# EAGLE design BlankMSXCart (EAGLE 7.5.0)
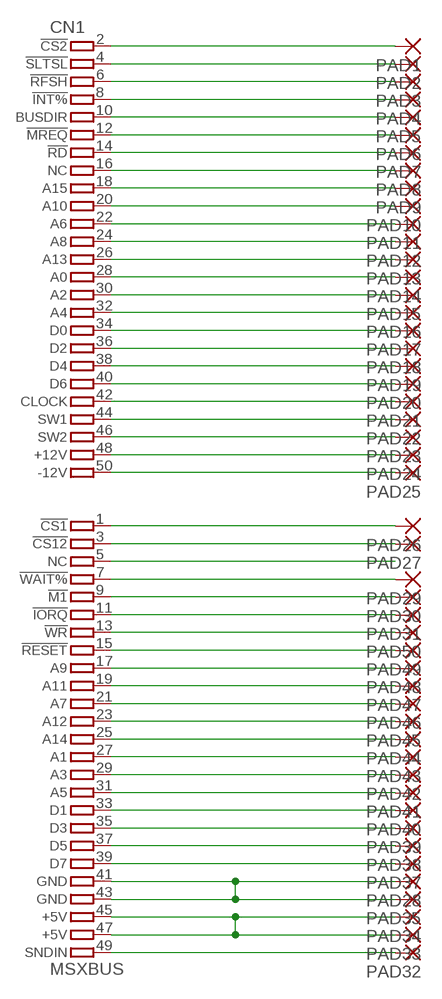
[diagram p0: schematic, sheet 1]

## Parts
CN1  MSXBUS  MSXBUS_EDGE  [MSXBUS_EDGECONN]
PAD1  1,6/0,8  [1,6/0,8]
PAD2  1,6/0,8  [1,6/0,8]
PAD3  1,6/0,8  [1,6/0,8]
PAD4  1,6/0,8  [1,6/0,8]
PAD5  1,6/0,8  [1,6/0,8]
PAD6  1,6/0,8  [1,6/0,8]
PAD7  1,6/0,8  [1,6/0,8]
PAD8  1,6/0,8  [1,6/0,8]
PAD9  1,6/0,8  [1,6/0,8]
PAD10  1,6/0,8  [1,6/0,8]
PAD11  1,6/0,8  [1,6/0,8]
PAD12  1,6/0,8  [1,6/0,8]
PAD13  1,6/0,8  [1,6/0,8]
PAD14  1,6/0,8  [1,6/0,8]
PAD15  1,6/0,8  [1,6/0,8]
PAD16  1,6/0,8  [1,6/0,8]
PAD17  1,6/0,8  [1,6/0,8]
PAD18  1,6/0,8  [1,6/0,8]
PAD19  1,6/0,8  [1,6/0,8]
PAD20  1,6/0,8  [1,6/0,8]
PAD21  1,6/0,8  [1,6/0,8]
PAD22  1,6/0,8  [1,6/0,8]
PAD23  1,6/0,8  [1,6/0,8]
PAD24  1,6/0,8  [1,6/0,8]
PAD25  1,6/0,8  [1,6/0,8]
PAD26  1,6/0,8  [1,6/0,8]
PAD27  1,6/0,8  [1,6/0,8]
PAD28  1,6/0,8  [1,6/0,8]
PAD29  1,6/0,8  [1,6/0,8]
PAD30  1,6/0,8  [1,6/0,8]
PAD31  1,6/0,8  [1,6/0,8]
PAD32  1,6/0,8  [1,6/0,8]
PAD33  1,6/0,8  [1,6/0,8]
PAD34  1,6/0,8  [1,6/0,8]
PAD35  1,6/0,8  [1,6/0,8]
PAD37  1,6/0,8  [1,6/0,8]
PAD38  1,6/0,8  [1,6/0,8]
PAD39  1,6/0,8  [1,6/0,8]
PAD40  1,6/0,8  [1,6/0,8]
PAD41  1,6/0,8  [1,6/0,8]
PAD42  1,6/0,8  [1,6/0,8]
PAD43  1,6/0,8  [1,6/0,8]
PAD44  1,6/0,8  [1,6/0,8]
PAD45  1,6/0,8  [1,6/0,8]
PAD46  1,6/0,8  [1,6/0,8]
PAD47  1,6/0,8  [1,6/0,8]
PAD48  1,6/0,8  [1,6/0,8]
PAD49  1,6/0,8  [1,6/0,8]
PAD50  1,6/0,8  [1,6/0,8]

## Nets
+5V: CN1.45(45.+5V) CN1.47(47.+5V) PAD33.1(P) PAD34.1(P)
GND: CN1.41(41.GND) CN1.43(43.GND) PAD28.1(P) PAD35.1(P)
N$1: CN1.2(2.!CS2) PAD1.1(P)
N$2: CN1.4(4.!SLTSL) PAD2.1(P)
N$4: CN1.6(6.!RFSH) PAD3.1(P)
N$6: CN1.8(8.!INT%) PAD4.1(P)
N$7: CN1.10(10.BUSDIR) PAD5.1(P)
N$8: CN1.12(12.!MREQ) PAD6.1(P)
N$9: CN1.14(14.!RD) PAD7.1(P)
N$10: CN1.16(16.NC) PAD8.1(P)
N$11: CN1.18(18.A15) PAD9.1(P)
N$12: CN1.20(20.A10) PAD10.1(P)
N$13: CN1.22(22.A6) PAD11.1(P)
N$14: CN1.24(24.A8) PAD12.1(P)
N$15: CN1.26(26.A13) PAD13.1(P)
N$16: CN1.28(28.A0) PAD14.1(P)
N$17: CN1.30(30.A2) PAD15.1(P)
N$18: CN1.32(32.A4) PAD16.1(P)
N$19: CN1.34(34.D0) PAD17.1(P)
N$20: CN1.36(36.D2) PAD18.1(P)
N$21: CN1.38(38.D4) PAD19.1(P)
N$22: CN1.40(40.D6) PAD20.1(P)
N$23: CN1.42(42.CLOCK) PAD21.1(P)
N$24: CN1.44(44.SW1) PAD22.1(P)
N$25: CN1.46(46.SW2) PAD23.1(P)
N$26: CN1.48(48.+12V) PAD24.1(P)
N$27: CN1.50(50.-12V) PAD25.1(P)
N$28: CN1.1(1.!CS1) PAD26.1(P)
N$29: CN1.3(3.!CS12) PAD27.1(P)
N$30: CN1.5(5.NC)
N$31: CN1.7(7.!WAIT%) PAD29.1(P)
N$32: CN1.9(9.!M1) PAD30.1(P)
N$33: CN1.11(11.!IORQ) PAD31.1(P)
N$34: CN1.49(49.SNDIN) PAD32.1(P)
N$39: CN1.39(39.D7) PAD37.1(P)
N$40: CN1.37(37.D5) PAD38.1(P)
N$41: CN1.35(35.D3) PAD39.1(P)
N$42: CN1.33(33.D1) PAD40.1(P)
N$43: CN1.31(31.A5) PAD41.1(P)
N$44: CN1.29(29.A3) PAD42.1(P)
N$45: CN1.27(27.A1) PAD43.1(P)
N$46: CN1.25(25.A14) PAD44.1(P)
N$47: CN1.23(23.A12) PAD45.1(P)
N$48: CN1.21(21.A7) PAD46.1(P)
N$49: CN1.19(19.A11) PAD47.1(P)
N$302: CN1.17(17.A9) PAD48.1(P)
N$303: CN1.15(15.!RESET) PAD49.1(P)
N$304: CN1.13(13.!WR) PAD50.1(P)

## Library data of the parts
CN1 = msx_breadboards:MSXBUS_EDGE: MSX bus (50 pin) edge connector Created 2013 by Eugeny Brychkov
PAD1-PAD35 PAD37-PAD50 = wirepad:1,6/0,8: THROUGH-HOLE PAD

## Board
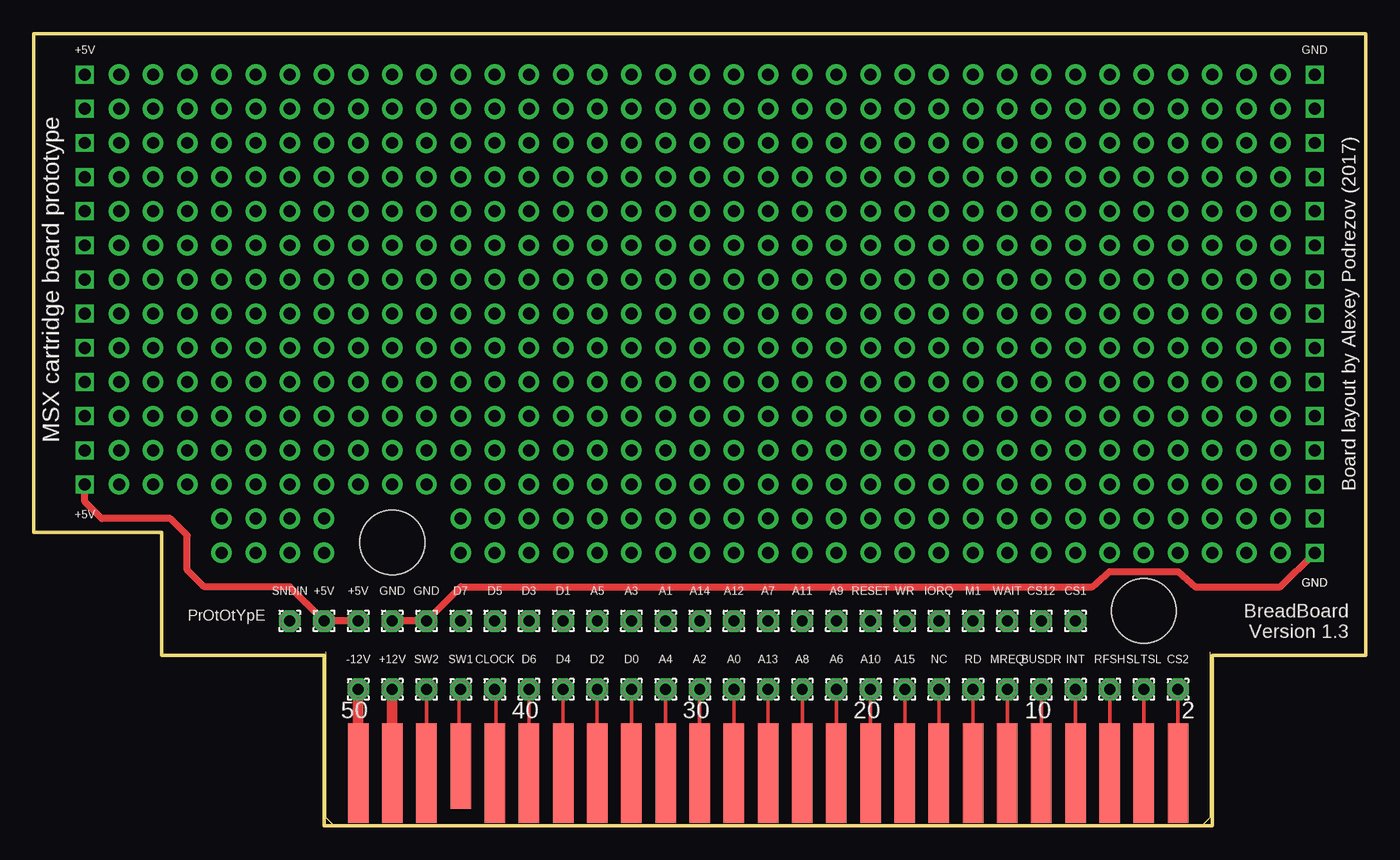
[diagram p1: board, top side]
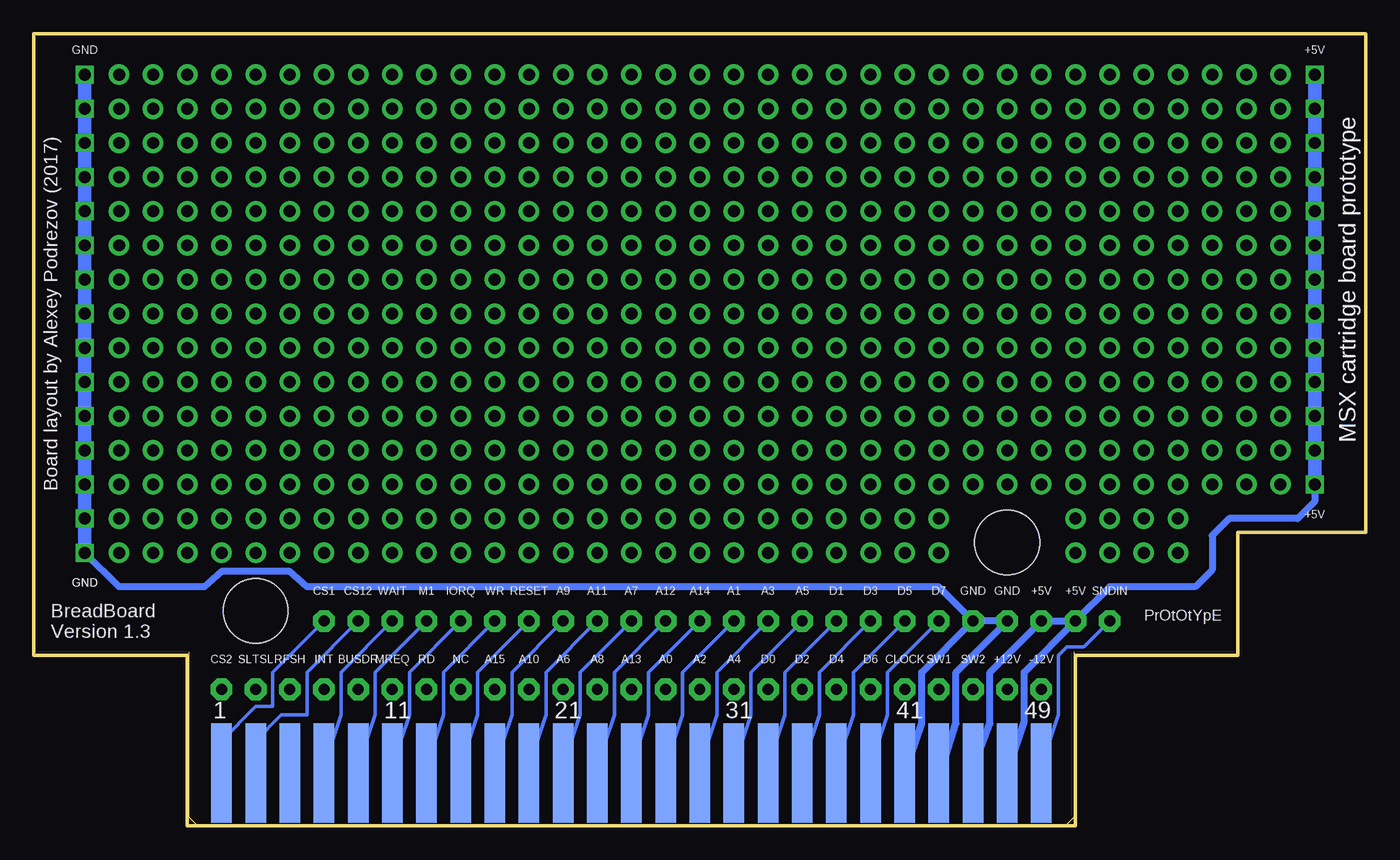
[diagram p2: board, bottom side, seen from below]

Size 99.06 x 58.93 mm. Coordinates in mm from the lower left corner, seen from the top.
Outline: 87.63,12.7 99.06,12.7 99.06,58.93 0,58.93 0,21.84 9.53,21.84 9.53,12.7 21.59,12.7 21.59,0 87.63,0 87.63,12.7
Copper layers (1*16): Top 0.035mm / dielectric 1.5mm / Bottom 0.035mm
Design rules "default *": minimum track width 10mil, minimum drill 24mil, track to track 8mil, track to pad 8mil, pad to pad 8mil, via to via 8mil, smd to smd 8mil, copper to edge 10mil, drill to drill 8mil, minimum pad ring 10mil, minimum via ring 8mil, stop-mask expansion 4mil, vias tented up to drill 0mil, thermal gap 20mil

### Footprints (pad centres in the part's own frame; a part is rotated, then mirrored left to right if it is on the bottom)
MSXBUS_EDGECONN = smd 1.524 x 7.366 bottom: 1 30.48,3.937; 3 27.94,3.937; 5 25.4,3.937; 7 22.86,3.937; 9 20.32,3.937; 11 17.78,3.937; 13 15.24,3.937; 15 12.7,3.937; 17 10.16,3.937; 19 7.62,3.937; 21 5.08,3.937; 23 2.54,3.937; 25 0,3.937; 27 -2.54,3.937; 29 -5.08,3.937; 31 -7.62,3.937; 33 -10.16,3.937; 35 -12.7,3.937; 37 -15.24,3.937; 39 -17.78,3.937; 41 -20.32,3.937; 43 -22.86,3.937; 45 -25.4,3.937; 47 -27.94,3.937; 49 -30.48,3.937 | smd 1.524 x 7.366: 2 30.48,3.937; 4 27.94,3.937; 6 25.4,3.937; 8 22.86,3.937; 10 20.32,3.937; 12 17.78,3.937; 14 15.24,3.937; 16 12.7,3.937; 18 10.16,3.937; 20 7.62,3.937; 22 5.08,3.937; 24 2.54,3.937; 26 0,3.937; 28 -2.54,3.937; 30 -5.08,3.937; 32 -7.62,3.937; 34 -10.16,3.937; 36 -12.7,3.937; 38 -15.24,3.937; 40 -17.78,3.937; 42 -20.32,3.937; 46 -25.4,3.937; 48 -27.94,3.937; 50 -30.48,3.937 | smd 1.524 x 6.35: 44 -22.86,4.445 | hole 4.826: -27.94,21.082; 27.94,16.002
1,6/0,8 = drill 0.813 pad 1.6 octagon: 1 0,0

### Placement (x,y rotation side)
CN1  54.61,0 0 top
PAD1  85.09,10.16 0 top
PAD2  82.55,10.16 0 top
PAD3  80.01,10.16 0 top
PAD4  77.47,10.16 0 top
PAD5  74.93,10.16 0 top
PAD6  72.39,10.16 0 top
PAD7  69.85,10.16 0 top
PAD8  67.31,10.16 0 top
PAD9  64.77,10.16 0 top
PAD10  62.23,10.16 0 top
PAD11  59.69,10.16 0 top
PAD12  57.15,10.16 0 top
PAD13  54.61,10.16 0 top
PAD14  52.07,10.16 0 top
PAD15  49.53,10.16 0 top
PAD16  46.99,10.16 0 top
PAD17  44.45,10.16 0 top
PAD18  41.91,10.16 0 top
PAD19  39.37,10.16 0 top
PAD20  36.83,10.16 0 top
PAD21  34.29,10.16 0 top
PAD22  31.75,10.16 0 top
PAD23  29.21,10.16 0 top
PAD24  26.67,10.16 0 top
PAD25  24.13,10.16 0 top
PAD26  77.47,15.24 0 top
PAD27  74.93,15.24 0 top
PAD28  29.21,15.24 0 top
PAD29  72.39,15.24 0 top
PAD30  69.85,15.24 0 top
PAD31  67.31,15.24 0 top
PAD32  19.05,15.24 0 top
PAD33  21.59,15.24 0 top
PAD34  24.13,15.24 0 top
PAD35  26.67,15.24 0 top
PAD37  31.75,15.24 0 top
PAD38  34.29,15.24 0 top
PAD39  36.83,15.24 0 top
PAD40  39.37,15.24 0 top
PAD41  41.91,15.24 0 top
PAD42  44.45,15.24 0 top
PAD43  46.99,15.24 0 top
PAD44  49.53,15.24 0 top
PAD45  52.07,15.24 0 top
PAD46  54.61,15.24 0 top
PAD47  57.15,15.24 0 top
PAD48  59.69,15.24 0 top
PAD49  62.23,15.24 0 top
PAD50  64.77,15.24 0 top

### Tracks (layer width: path | path; a pad name or v marks a point on that pad's centre or on a via)
+5V  (via drill 0.89)
  Top 0.508: PAD34.1 PAD33.1 19.05,17.78 12.7,17.78 11.43,19.05 11.43,21.59 10.16,22.86 5.08,22.86 3.81,24.13 v3.81,25.4
  Bottom 0.406: CN1.45 29.34,3.94
  Bottom 0.508: v3.81,25.4 3.81,24.13 5.08,22.86 10.16,22.86 11.43,21.59 11.43,19.05 12.7,17.78 19.05,17.78 PAD33.1 | CN1.47 25.4,7.75 25.4,11.43 PAD33.1 | 29.34,3.94 27.94,7.62 27.94,11.43 PAD34.1 PAD33.1
  Bottom 1.016: v3.81,55.88 v3.81,53.34 v3.81,50.8 v3.81,48.26 v3.81,45.72 v3.81,43.18 v3.81,40.64 v3.81,38.1 v3.81,35.56 v3.81,33.02 v3.81,30.48 v3.81,27.94 v3.81,25.4
GND  (via drill 0.89)
  Top 0.508: v95.25,20.32 92.71,17.78 86.36,17.78 85.09,18.92 80.01,18.92 78.74,17.78 31.75,17.78 PAD28.1 PAD35.1
  Bottom 0.406: CN1.43 31.62,3.94
  Bottom 0.508: CN1.41 33.02,7.62 33.02,11.43 PAD28.1 | PAD28.1 31.75,17.78 78.74,17.78 80.01,18.92 85.09,18.92 86.36,17.78 92.71,17.78 v95.25,20.32 | 31.62,3.94 30.48,7.62 30.48,11.43 PAD35.1 PAD28.1
  Bottom 1.016: v95.25,55.88 v95.25,53.34 v95.25,50.8 v95.25,48.26 v95.25,45.72 v95.25,43.18 v95.25,40.64 v95.25,38.1 v95.25,35.56 v95.25,33.02 v95.25,30.48 v95.25,27.94 v95.25,25.4 v95.25,22.86 v95.25,20.32
N$1
  Top 0.254: CN1.2 PAD1.1
N$2
  Top 0.254: CN1.4 PAD2.1
N$4
  Top 0.254: CN1.6 PAD3.1
N$5  (via drill 0.89 pad 1.52)
  other vias: 8.89,25.4
N$6
  Top 0.254: CN1.8 PAD4.1
N$7
  Top 0.254: CN1.10 PAD5.1
N$8
  Top 0.254: CN1.12 PAD6.1
N$9
  Top 0.254: CN1.14 PAD7.1
N$10
  Top 0.254: CN1.16 PAD8.1
N$11
  Top 0.254: CN1.18 PAD9.1
N$12
  Top 0.254: CN1.20 PAD10.1
N$13
  Top 0.254: CN1.22 PAD11.1
N$14
  Top 0.254: CN1.24 PAD12.1
N$15
  Top 0.254: CN1.26 PAD13.1
N$16
  Top 0.254: CN1.28 PAD14.1
N$17
  Top 0.254: CN1.30 PAD15.1
N$18
  Top 0.254: CN1.32 PAD16.1
N$19
  Top 0.254: CN1.34 PAD17.1
N$20
  Top 0.254: CN1.36 PAD18.1
N$21
  Top 0.254: CN1.38 PAD19.1
N$22
  Top 0.254: CN1.40 PAD20.1
N$23
  Top 0.254: PAD21.1 34.39,10.06 34.39,4.12 CN1.42
N$24
  Top 0.254: PAD22.1 31.65,10.06 31.65,4.57 CN1.44
N$25
  Top 0.254: CN1.46 PAD23.1
N$26
  Top 0.762: CN1.48 PAD24.1
N$27
  Top 0.762: CN1.50 PAD25.1
N$28
  Bottom 0.254: PAD26.1 81.28,11.43 81.28,8.89 82.55,8.89 85.09,6.35 CN1.1
N$29
  Bottom 0.254: PAD27.1 78.74,11.43 78.74,8.26 80.65,8.26 82.55,6.35 CN1.3
N$31
  Bottom 0.254: PAD29.1 76.2,11.43 76.2,8.26 77.47,4.45 CN1.7
N$32
  Bottom 0.254: PAD30.1 73.66,11.43 73.66,8.26 74.93,4.45 CN1.9
N$33
  Bottom 0.254: PAD31.1 71.12,11.43 71.12,8.26 72.39,4.45 CN1.11
N$34
  Bottom 0.254: PAD32.1 20.96,13.34 22.23,13.34 22.86,12.7 22.86,8.26 24.13,4.45 CN1.49
N$35  (via drill 0.89 pad 1.52)
  other vias: 8.89,27.94
N$36  (via drill 0.89 pad 1.52)
  other vias: 8.89,30.48
N$37  (via drill 0.89 pad 1.52)
  other vias: 8.89,33.02
N$38  (via drill 0.89 pad 1.52)
  other vias: 8.89,35.56
N$39
  Bottom 0.254: PAD37.1 35.56,11.43 35.56,8.26 36.83,4.45 CN1.39
N$40
  Bottom 0.254: PAD38.1 38.1,11.43 38.1,8.26 39.37,4.45 CN1.37
N$41
  Bottom 0.254: PAD39.1 40.64,11.43 40.64,8.26 41.91,4.45 CN1.35
N$42
  Bottom 0.254: PAD40.1 43.18,11.43 43.18,8.26 44.45,4.45 CN1.33
N$43
  Bottom 0.254: PAD41.1 45.72,11.43 45.72,8.26 46.99,4.45 CN1.31
N$44
  Bottom 0.254: PAD42.1 48.26,11.43 48.26,8.26 49.53,4.45 CN1.29
N$45
  Bottom 0.254: PAD43.1 50.8,11.43 50.8,8.26 52.07,4.45 CN1.27
N$46
  Bottom 0.254: PAD44.1 53.34,11.43 53.34,8.26 54.61,4.45 CN1.25
N$47
  Bottom 0.254: PAD45.1 55.88,11.43 55.88,8.26 57.15,4.45 CN1.23
N$48
  Bottom 0.254: PAD46.1 58.42,11.43 58.42,8.26 59.69,4.45 CN1.21
N$49
  Bottom 0.254: PAD47.1 60.96,11.43 60.96,8.26 62.23,4.45 CN1.19
N$50  (via drill 0.89 pad 1.52)
  other vias: 8.89,38.1
N$51  (via drill 0.89 pad 1.52)
  other vias: 8.89,40.64
N$52  (via drill 0.89 pad 1.52)
  other vias: 8.89,43.18
N$53  (via drill 0.89 pad 1.52)
  other vias: 8.89,45.72
N$54  (via drill 0.89 pad 1.52)
  other vias: 8.89,48.26
N$55  (via drill 0.89 pad 1.52)
  other vias: 8.89,50.8
N$56  (via drill 0.89 pad 1.52)
  other vias: 8.89,53.34
N$57  (via drill 0.89 pad 1.52)
  other vias: 8.89,55.88
N$58  (via drill 0.89 pad 1.52)
  other vias: 11.43,25.4
N$59  (via drill 0.89 pad 1.52)
  other vias: 11.43,27.94
N$60  (via drill 0.89 pad 1.52)
  other vias: 11.43,30.48
N$61  (via drill 0.89 pad 1.52)
  other vias: 11.43,33.02
N$62  (via drill 0.89 pad 1.52)
  other vias: 11.43,35.56
N$63  (via drill 0.89 pad 1.52)
  other vias: 11.43,38.1
N$64  (via drill 0.89 pad 1.52)
  other vias: 11.43,40.64
N$65  (via drill 0.89 pad 1.52)
  other vias: 11.43,43.18
N$66  (via drill 0.89 pad 1.52)
  other vias: 11.43,45.72
N$67  (via drill 0.89 pad 1.52)
  other vias: 11.43,48.26
N$68  (via drill 0.89 pad 1.52)
  other vias: 11.43,50.8
N$69  (via drill 0.89 pad 1.52)
  other vias: 11.43,53.34
N$70  (via drill 0.89 pad 1.52)
  other vias: 11.43,55.88
N$71  (via drill 0.89 pad 1.52)
  other vias: 13.97,25.4
N$72  (via drill 0.89 pad 1.52)
  other vias: 13.97,27.94
N$73  (via drill 0.89 pad 1.52)
  other vias: 13.97,30.48
N$74  (via drill 0.89 pad 1.52)
  other vias: 13.97,33.02
N$75  (via drill 0.89 pad 1.52)
  other vias: 13.97,35.56
N$76  (via drill 0.89 pad 1.52)
  other vias: 13.97,38.1
N$77  (via drill 0.89 pad 1.52)
  other vias: 13.97,40.64
N$78  (via drill 0.89 pad 1.52)
  other vias: 13.97,43.18
N$79  (via drill 0.89 pad 1.52)
  other vias: 13.97,45.72
N$80  (via drill 0.89 pad 1.52)
  other vias: 13.97,48.26
N$81  (via drill 0.89 pad 1.52)
  other vias: 13.97,50.8
N$82  (via drill 0.89 pad 1.52)
  other vias: 13.97,53.34
N$83  (via drill 0.89 pad 1.52)
  other vias: 13.97,55.88
N$84  (via drill 0.89 pad 1.52)
  other vias: 16.51,25.4
N$85  (via drill 0.89 pad 1.52)
  other vias: 16.51,27.94
N$86  (via drill 0.89 pad 1.52)
  other vias: 16.51,30.48
N$87  (via drill 0.89 pad 1.52)
  other vias: 16.51,33.02
N$88  (via drill 0.89 pad 1.52)
  other vias: 16.51,35.56
N$89  (via drill 0.89 pad 1.52)
  other vias: 16.51,38.1
N$90  (via drill 0.89 pad 1.52)
  other vias: 16.51,40.64
N$91  (via drill 0.89 pad 1.52)
  other vias: 16.51,43.18
N$92  (via drill 0.89 pad 1.52)
  other vias: 16.51,45.72
N$93  (via drill 0.89 pad 1.52)
  other vias: 16.51,48.26
N$94  (via drill 0.89 pad 1.52)
  other vias: 16.51,50.8
N$95  (via drill 0.89 pad 1.52)
  other vias: 16.51,53.34
N$96  (via drill 0.89 pad 1.52)
  other vias: 16.51,55.88
N$97  (via drill 0.89 pad 1.52)
  other vias: 19.05,25.4
N$98  (via drill 0.89 pad 1.52)
  other vias: 19.05,27.94
N$99  (via drill 0.89 pad 1.52)
  other vias: 19.05,30.48
N$100  (via drill 0.89 pad 1.52)
  other vias: 19.05,33.02
N$101  (via drill 0.89 pad 1.52)
  other vias: 19.05,35.56
N$102  (via drill 0.89 pad 1.52)
  other vias: 19.05,38.1
N$103  (via drill 0.89 pad 1.52)
  other vias: 19.05,40.64
N$104  (via drill 0.89 pad 1.52)
  other vias: 19.05,43.18
N$105  (via drill 0.89 pad 1.52)
  other vias: 19.05,45.72
N$106  (via drill 0.89 pad 1.52)
  other vias: 19.05,48.26
N$107  (via drill 0.89 pad 1.52)
  other vias: 19.05,50.8
N$108  (via drill 0.89 pad 1.52)
  other vias: 19.05,53.34
N$109  (via drill 0.89 pad 1.52)
  other vias: 19.05,55.88
N$110  (via drill 0.89 pad 1.52)
  other vias: 21.59,25.4
N$111  (via drill 0.89 pad 1.52)
  other vias: 21.59,27.94
N$112  (via drill 0.89 pad 1.52)
  other vias: 21.59,30.48
N$113  (via drill 0.89 pad 1.52)
  other vias: 21.59,33.02
N$114  (via drill 0.89 pad 1.52)
  other vias: 21.59,35.56
N$115  (via drill 0.89 pad 1.52)
  other vias: 21.59,38.1
N$116  (via drill 0.89 pad 1.52)
  other vias: 21.59,40.64
N$117  (via drill 0.89 pad 1.52)
  other vias: 21.59,43.18
N$118  (via drill 0.89 pad 1.52)
  other vias: 21.59,45.72
N$119  (via drill 0.89 pad 1.52)
  other vias: 21.59,48.26
N$120  (via drill 0.89 pad 1.52)
  other vias: 21.59,50.8
N$121  (via drill 0.89 pad 1.52)
  other vias: 21.59,53.34
N$122  (via drill 0.89 pad 1.52)
  other vias: 21.59,55.88
N$123  (via drill 0.89 pad 1.52)
  other vias: 24.13,25.4
N$124  (via drill 0.89 pad 1.52)
  other vias: 24.13,27.94
N$125  (via drill 0.89 pad 1.52)
  other vias: 24.13,30.48
N$126  (via drill 0.89 pad 1.52)
  other vias: 24.13,33.02
N$127  (via drill 0.89 pad 1.52)
  other vias: 24.13,35.56
N$128  (via drill 0.89 pad 1.52)
  other vias: 24.13,38.1
N$129  (via drill 0.89 pad 1.52)
  other vias: 24.13,40.64
N$130  (via drill 0.89 pad 1.52)
  other vias: 24.13,43.18
N$131  (via drill 0.89 pad 1.52)
  other vias: 24.13,45.72
N$132  (via drill 0.89 pad 1.52)
  other vias: 24.13,48.26
N$133  (via drill 0.89 pad 1.52)
  other vias: 24.13,50.8
N$134  (via drill 0.89 pad 1.52)
  other vias: 6.35,25.4
N$135  (via drill 0.89 pad 1.52)
  other vias: 24.13,53.34
N$136  (via drill 0.89 pad 1.52)
  other vias: 24.13,55.88
N$137  (via drill 0.89 pad 1.52)
  other vias: 26.67,25.4
N$138  (via drill 0.89 pad 1.52)
  other vias: 26.67,27.94
N$139  (via drill 0.89 pad 1.52)
  other vias: 26.67,30.48
N$140  (via drill 0.89 pad 1.52)
  other vias: 26.67,33.02
N$141  (via drill 0.89 pad 1.52)
  other vias: 26.67,35.56
N$142  (via drill 0.89 pad 1.52)
  other vias: 26.67,38.1
N$143  (via drill 0.89 pad 1.52)
  other vias: 26.67,40.64
N$144  (via drill 0.89 pad 1.52)
  other vias: 26.67,43.18
N$145  (via drill 0.89 pad 1.52)
  other vias: 26.67,45.72
N$146  (via drill 0.89 pad 1.52)
  other vias: 26.67,48.26
N$147  (via drill 0.89 pad 1.52)
  other vias: 26.67,50.8
N$148  (via drill 0.89 pad 1.52)
  other vias: 26.67,53.34
N$149  (via drill 0.89 pad 1.52)
  other vias: 26.67,55.88
N$150  (via drill 0.89 pad 1.52)
  other vias: 29.21,25.4
N$151  (via drill 0.89 pad 1.52)
  other vias: 29.21,27.94
N$152  (via drill 0.89 pad 1.52)
  other vias: 29.21,30.48
N$153  (via drill 0.89 pad 1.52)
  other vias: 29.21,33.02
N$154  (via drill 0.89 pad 1.52)
  other vias: 29.21,35.56
N$155  (via drill 0.89 pad 1.52)
  other vias: 29.21,38.1
N$156  (via drill 0.89 pad 1.52)
  other vias: 29.21,40.64
N$157  (via drill 0.89 pad 1.52)
  other vias: 29.21,43.18
N$158  (via drill 0.89 pad 1.52)
  other vias: 29.21,45.72
N$159  (via drill 0.89 pad 1.52)
  other vias: 29.21,48.26
N$160  (via drill 0.89 pad 1.52)
  other vias: 29.21,50.8
N$161  (via drill 0.89 pad 1.52)
  other vias: 29.21,53.34
N$162  (via drill 0.89 pad 1.52)
  other vias: 29.21,55.88
N$163  (via drill 0.89 pad 1.52)
  other vias: 31.75,25.4
N$164  (via drill 0.89 pad 1.52)
  other vias: 6.35,27.94
N$165  (via drill 0.89 pad 1.52)
  other vias: 31.75,27.94
N$166  (via drill 0.89 pad 1.52)
  other vias: 31.75,30.48
N$167  (via drill 0.89 pad 1.52)
  other vias: 31.75,33.02
N$168  (via drill 0.89 pad 1.52)
  other vias: 31.75,35.56
N$169  (via drill 0.89 pad 1.52)
  other vias: 31.75,38.1
N$170  (via drill 0.89 pad 1.52)
  other vias: 31.75,40.64
N$171  (via drill 0.89 pad 1.52)
  other vias: 31.75,43.18
N$172  (via drill 0.89 pad 1.52)
  other vias: 31.75,45.72
N$173  (via drill 0.89 pad 1.52)
  other vias: 31.75,48.26
N$174  (via drill 0.89 pad 1.52)
  other vias: 31.75,50.8
N$175  (via drill 0.89 pad 1.52)
  other vias: 31.75,53.34
N$176  (via drill 0.89 pad 1.52)
  other vias: 31.75,55.88
N$177  (via drill 0.89 pad 1.52)
  other vias: 34.29,25.4
N$178  (via drill 0.89 pad 1.52)
  other vias: 34.29,27.94
N$179  (via drill 0.89 pad 1.52)
  other vias: 34.29,30.48
N$180  (via drill 0.89 pad 1.52)
  other vias: 34.29,33.02
N$181  (via drill 0.89 pad 1.52)
  other vias: 34.29,35.56
N$182  (via drill 0.89 pad 1.52)
  other vias: 34.29,38.1
N$183  (via drill 0.89 pad 1.52)
  other vias: 34.29,40.64
N$184  (via drill 0.89 pad 1.52)
  other vias: 34.29,43.18
N$185  (via drill 0.89 pad 1.52)
  other vias: 34.29,45.72
N$186  (via drill 0.89 pad 1.52)
  other vias: 34.29,48.26
N$187  (via drill 0.89 pad 1.52)
  other vias: 34.29,50.8
N$188  (via drill 0.89 pad 1.52)
  other vias: 34.29,53.34
N$189  (via drill 0.89 pad 1.52)
  other vias: 34.29,55.88
N$190  (via drill 0.89 pad 1.52)
  other vias: 36.83,25.4
N$191  (via drill 0.89 pad 1.52)
  other vias: 36.83,27.94
N$192  (via drill 0.89 pad 1.52)
  other vias: 36.83,30.48
N$193  (via drill 0.89 pad 1.52)
  other vias: 36.83,33.02
N$194  (via drill 0.89 pad 1.52)
  other vias: 36.83,35.56
N$195  (via drill 0.89 pad 1.52)
  other vias: 36.83,38.1
N$196  (via drill 0.89 pad 1.52)
  other vias: 36.83,40.64
N$197  (via drill 0.89 pad 1.52)
  other vias: 6.35,30.48
N$198  (via drill 0.89 pad 1.52)
  other vias: 36.83,43.18
N$199  (via drill 0.89 pad 1.52)
  other vias: 36.83,45.72
N$200  (via drill 0.89 pad 1.52)
  other vias: 36.83,48.26
N$201  (via drill 0.89 pad 1.52)
  other vias: 36.83,50.8
N$202  (via drill 0.89 pad 1.52)
  other vias: 36.83,53.34
N$203  (via drill 0.89 pad 1.52)
  other vias: 36.83,55.88
N$204  (via drill 0.89 pad 1.52)
  other vias: 39.37,25.4
N$205  (via drill 0.89 pad 1.52)
  other vias: 39.37,27.94
N$206  (via drill 0.89 pad 1.52)
  other vias: 39.37,30.48
N$207  (via drill 0.89 pad 1.52)
  other vias: 39.37,33.02
N$208  (via drill 0.89 pad 1.52)
  other vias: 39.37,35.56
N$209  (via drill 0.89 pad 1.52)
  other vias: 39.37,38.1
N$210  (via drill 0.89 pad 1.52)
  other vias: 39.37,40.64
N$211  (via drill 0.89 pad 1.52)
  other vias: 39.37,43.18
N$212  (via drill 0.89 pad 1.52)
  other vias: 39.37,45.72
N$213  (via drill 0.89 pad 1.52)
  other vias: 39.37,48.26
N$214  (via drill 0.89 pad 1.52)
  other vias: 39.37,50.8
N$215  (via drill 0.89 pad 1.52)
  other vias: 39.37,53.34
N$216  (via drill 0.89 pad 1.52)
  other vias: 39.37,55.88
N$217  (via drill 0.89 pad 1.52)
  other vias: 41.91,25.4
N$218  (via drill 0.89 pad 1.52)
  other vias: 41.91,27.94
N$219  (via drill 0.89 pad 1.52)
  other vias: 41.91,30.48
N$220  (via drill 0.89 pad 1.52)
  other vias: 41.91,33.02
N$221  (via drill 0.89 pad 1.52)
  other vias: 41.91,35.56
N$222  (via drill 0.89 pad 1.52)
  other vias: 41.91,38.1
N$223  (via drill 0.89 pad 1.52)
  other vias: 41.91,40.64
N$224  (via drill 0.89 pad 1.52)
  other vias: 41.91,43.18
N$225  (via drill 0.89 pad 1.52)
  other vias: 41.91,45.72
N$226  (via drill 0.89 pad 1.52)
  other vias: 41.91,48.26
N$227  (via drill 0.89 pad 1.52)
  other vias: 41.91,50.8
N$228  (via drill 0.89 pad 1.52)
  other vias: 41.91,53.34
N$229  (via drill 0.89 pad 1.52)
  other vias: 41.91,55.88
N$230  (via drill 0.89 pad 1.52)
  other vias: 6.35,33.02
N$231  (via drill 0.89 pad 1.52)
  other vias: 44.45,25.4
N$232  (via drill 0.89 pad 1.52)
  other vias: 44.45,27.94
N$233  (via drill 0.89 pad 1.52)
  other vias: 44.45,30.48
N$234  (via drill 0.89 pad 1.52)
  other vias: 44.45,33.02
N$235  (via drill 0.89 pad 1.52)
  other vias: 44.45,35.56
N$236  (via drill 0.89 pad 1.52)
  other vias: 44.45,38.1
N$237  (via drill 0.89 pad 1.52)
  other vias: 44.45,40.64
N$238  (via drill 0.89 pad 1.52)
  other vias: 44.45,43.18
N$239  (via drill 0.89 pad 1.52)
  other vias: 44.45,45.72
N$240  (via drill 0.89 pad 1.52)
  other vias: 44.45,48.26
N$241  (via drill 0.89 pad 1.52)
  other vias: 44.45,50.8
N$242  (via drill 0.89 pad 1.52)
  other vias: 44.45,53.34
N$243  (via drill 0.89 pad 1.52)
  other vias: 44.45,55.88
N$244  (via drill 0.89 pad 1.52)
  other vias: 46.99,25.4
N$245  (via drill 0.89 pad 1.52)
  other vias: 46.99,27.94
N$246  (via drill 0.89 pad 1.52)
  other vias: 46.99,30.48
N$247  (via drill 0.89 pad 1.52)
  other vias: 46.99,33.02
N$248  (via drill 0.89 pad 1.52)
  other vias: 46.99,35.56
N$249  (via drill 0.89 pad 1.52)
  other vias: 46.99,38.1
N$250  (via drill 0.89 pad 1.52)
  other vias: 46.99,40.64
N$251  (via drill 0.89 pad 1.52)
  other vias: 46.99,43.18
N$252  (via drill 0.89 pad 1.52)
  other vias: 46.99,45.72
N$253  (via drill 0.89 pad 1.52)
  other vias: 46.99,48.26
N$254  (via drill 0.89 pad 1.52)
  other vias: 46.99,50.8
N$255  (via drill 0.89 pad 1.52)
  other vias: 46.99,53.34
N$256  (via drill 0.89 pad 1.52)
  other vias: 46.99,55.88
N$257  (via drill 0.89 pad 1.52)
  other vias: 49.53,25.4
N$258  (via drill 0.89 pad 1.52)
  other vias: 49.53,27.94
N$259  (via drill 0.89 pad 1.52)
  other vias: 49.53,30.48
N$260  (via drill 0.89 pad 1.52)
  other vias: 49.53,33.02
N$261  (via drill 0.89 pad 1.52)
  other vias: 49.53,35.56
N$262  (via drill 0.89 pad 1.52)
  other vias: 49.53,38.1
N$263  (via drill 0.89 pad 1.52)
  other vias: 6.35,35.56
N$264  (via drill 0.89 pad 1.52)
  other vias: 49.53,40.64
N$265  (via drill 0.89 pad 1.52)
  other vias: 49.53,43.18
N$266  (via drill 0.89 pad 1.52)
  other vias: 49.53,45.72
N$267  (via drill 0.89 pad 1.52)
  other vias: 49.53,48.26
N$268  (via drill 0.89 pad 1.52)
  other vias: 49.53,50.8
N$269  (via drill 0.89 pad 1.52)
  other vias: 49.53,53.34
N$270  (via drill 0.89 pad 1.52)
  other vias: 49.53,55.88
N$271  (via drill 0.89 pad 1.52)
  other vias: 52.07,25.4
N$272  (via drill 0.89 pad 1.52)
  other vias: 52.07,27.94
N$273  (via drill 0.89 pad 1.52)
  other vias: 52.07,30.48
N$274  (via drill 0.89 pad 1.52)
  other vias: 52.07,33.02
N$275  (via drill 0.89 pad 1.52)
  other vias: 52.07,35.56
N$276  (via drill 0.89 pad 1.52)
  other vias: 52.07,38.1
N$277  (via drill 0.89 pad 1.52)
  other vias: 52.07,40.64
N$278  (via drill 0.89 pad 1.52)
  other vias: 52.07,43.18
N$279  (via drill 0.89 pad 1.52)
  other vias: 52.07,45.72
N$280  (via drill 0.89 pad 1.52)
  other vias: 52.07,48.26
N$281  (via drill 0.89 pad 1.52)
  other vias: 52.07,50.8
N$282  (via drill 0.89 pad 1.52)
  other vias: 52.07,53.34
N$283  (via drill 0.89 pad 1.52)
  other vias: 52.07,55.88
N$284  (via drill 0.89 pad 1.52)
  other vias: 54.61,25.4
N$285  (via drill 0.89 pad 1.52)
  other vias: 54.61,27.94
N$286  (via drill 0.89 pad 1.52)
  other vias: 54.61,30.48
N$287  (via drill 0.89 pad 1.52)
  other vias: 54.61,33.02
N$288  (via drill 0.89 pad 1.52)
  other vias: 54.61,35.56
N$289  (via drill 0.89 pad 1.52)
  other vias: 54.61,38.1
N$290  (via drill 0.89 pad 1.52)
  other vias: 54.61,40.64
N$291  (via drill 0.89 pad 1.52)
  other vias: 54.61,43.18
N$292  (via drill 0.89 pad 1.52)
  other vias: 54.61,45.72
N$293  (via drill 0.89 pad 1.52)
  other vias: 54.61,48.26
N$294  (via drill 0.89 pad 1.52)
  other vias: 54.61,50.8
N$295  (via drill 0.89 pad 1.52)
  other vias: 54.61,53.34
N$296  (via drill 0.89 pad 1.52)
  other vias: 6.35,38.1
N$297  (via drill 0.89 pad 1.52)
  other vias: 54.61,55.88
N$298  (via drill 0.89 pad 1.52)
  other vias: 57.15,25.4
N$299  (via drill 0.89 pad 1.52)
  other vias: 57.15,27.94
N$300  (via drill 0.89 pad 1.52)
  other vias: 57.15,30.48
N$301  (via drill 0.89 pad 1.52)
  other vias: 57.15,33.02
N$302
  Bottom 0.254: PAD48.1 63.5,11.43 63.5,8.26 64.77,4.45 CN1.17
N$303
  Bottom 0.254: PAD49.1 66.04,11.43 66.04,8.26 67.31,4.45 CN1.15
N$304
  Bottom 0.254: PAD50.1 68.58,11.43 68.58,8.26 69.85,4.45 CN1.13
N$305  (via drill 0.89 pad 1.52)
  other vias: 57.15,35.56
N$306  (via drill 0.89 pad 1.52)
  other vias: 57.15,38.1
N$307  (via drill 0.89 pad 1.52)
  other vias: 57.15,40.64
N$308  (via drill 0.89 pad 1.52)
  other vias: 57.15,43.18
N$309  (via drill 0.89 pad 1.52)
  other vias: 57.15,45.72
N$310  (via drill 0.89 pad 1.52)
  other vias: 57.15,48.26
N$311  (via drill 0.89 pad 1.52)
  other vias: 57.15,50.8
N$312  (via drill 0.89 pad 1.52)
  other vias: 57.15,53.34
N$313  (via drill 0.89 pad 1.52)
  other vias: 57.15,55.88
N$314  (via drill 0.89 pad 1.52)
  other vias: 59.69,25.4
N$315  (via drill 0.89 pad 1.52)
  other vias: 59.69,27.94
N$316  (via drill 0.89 pad 1.52)
  other vias: 59.69,30.48
N$317  (via drill 0.89 pad 1.52)
  other vias: 59.69,33.02
N$318  (via drill 0.89 pad 1.52)
  other vias: 59.69,35.56
N$319  (via drill 0.89 pad 1.52)
  other vias: 59.69,38.1
N$320  (via drill 0.89 pad 1.52)
  other vias: 59.69,40.64
N$321  (via drill 0.89 pad 1.52)
  other vias: 59.69,43.18
N$322  (via drill 0.89 pad 1.52)
  other vias: 59.69,45.72
N$323  (via drill 0.89 pad 1.52)
  other vias: 59.69,48.26
N$324  (via drill 0.89 pad 1.52)
  other vias: 59.69,50.8
N$325  (via drill 0.89 pad 1.52)
  other vias: 59.69,53.34
N$326  (via drill 0.89 pad 1.52)
  other vias: 59.69,55.88
N$327  (via drill 0.89 pad 1.52)
  other vias: 62.23,25.4
N$328  (via drill 0.89 pad 1.52)
  other vias: 62.23,27.94
N$329  (via drill 0.89 pad 1.52)
  other vias: 62.23,30.48
N$330  (via drill 0.89 pad 1.52)
  other vias: 62.23,33.02
N$331  (via drill 0.89 pad 1.52)
  other vias: 62.23,35.56
N$332  (via drill 0.89 pad 1.52)
  other vias: 6.35,40.64
N$333  (via drill 0.89 pad 1.52)
  other vias: 62.23,38.1
N$334  (via drill 0.89 pad 1.52)
  other vias: 62.23,40.64
N$335  (via drill 0.89 pad 1.52)
  other vias: 62.23,43.18
N$336  (via drill 0.89 pad 1.52)
  other vias: 62.23,45.72
N$337  (via drill 0.89 pad 1.52)
  other vias: 62.23,48.26
N$338  (via drill 0.89 pad 1.52)
  other vias: 62.23,50.8
N$339  (via drill 0.89 pad 1.52)
  other vias: 62.23,53.34
N$340  (via drill 0.89 pad 1.52)
  other vias: 62.23,55.88
N$341  (via drill 0.89 pad 1.52)
  other vias: 64.77,25.4
N$342  (via drill 0.89 pad 1.52)
  other vias: 64.77,27.94
N$343  (via drill 0.89 pad 1.52)
  other vias: 64.77,30.48
N$344  (via drill 0.89 pad 1.52)
  other vias: 64.77,33.02
N$345  (via drill 0.89 pad 1.52)
  other vias: 64.77,35.56
N$346  (via drill 0.89 pad 1.52)
  other vias: 64.77,38.1
N$347  (via drill 0.89 pad 1.52)
  other vias: 64.77,40.64
N$348  (via drill 0.89 pad 1.52)
  other vias: 64.77,43.18
N$349  (via drill 0.89 pad 1.52)
  other vias: 64.77,45.72
N$350  (via drill 0.89 pad 1.52)
  other vias: 64.77,48.26
N$351  (via drill 0.89 pad 1.52)
  other vias: 64.77,50.8
N$352  (via drill 0.89 pad 1.52)
  other vias: 64.77,53.34
N$353  (via drill 0.89 pad 1.52)
  other vias: 64.77,55.88
N$354  (via drill 0.89 pad 1.52)
  other vias: 67.31,25.4
N$355  (via drill 0.89 pad 1.52)
  other vias: 67.31,27.94
N$356  (via drill 0.89 pad 1.52)
  other vias: 67.31,30.48
N$357  (via drill 0.89 pad 1.52)
  other vias: 67.31,33.02
N$358  (via drill 0.89 pad 1.52)
  other vias: 67.31,35.56
N$359  (via drill 0.89 pad 1.52)
  other vias: 67.31,38.1
N$360  (via drill 0.89 pad 1.52)
  other vias: 67.31,40.64
N$361  (via drill 0.89 pad 1.52)
  other vias: 67.31,43.18
N$362  (via drill 0.89 pad 1.52)
  other vias: 67.31,45.72
N$363  (via drill 0.89 pad 1.52)
  other vias: 67.31,48.26
N$364  (via drill 0.89 pad 1.52)
  other vias: 67.31,50.8
N$365  (via drill 0.89 pad 1.52)
  other vias: 6.35,43.18
N$366  (via drill 0.89 pad 1.52)
  other vias: 67.31,53.34
N$367  (via drill 0.89 pad 1.52)
  other vias: 67.31,55.88
N$368  (via drill 0.89 pad 1.52)
  other vias: 69.85,25.4
N$369  (via drill 0.89 pad 1.52)
  other vias: 69.85,27.94
N$370  (via drill 0.89 pad 1.52)
  other vias: 69.85,30.48
N$371  (via drill 0.89 pad 1.52)
  other vias: 69.85,33.02
N$372  (via drill 0.89 pad 1.52)
  other vias: 69.85,35.56
N$373  (via drill 0.89 pad 1.52)
  other vias: 69.85,38.1
N$374  (via drill 0.89 pad 1.52)
  other vias: 69.85,40.64
N$375  (via drill 0.89 pad 1.52)
  other vias: 69.85,43.18
N$376  (via drill 0.89 pad 1.52)
  other vias: 69.85,45.72
N$377  (via drill 0.89 pad 1.52)
  other vias: 69.85,48.26
N$378  (via drill 0.89 pad 1.52)
  other vias: 69.85,50.8
N$379  (via drill 0.89 pad 1.52)
  other vias: 69.85,53.34
N$380  (via drill 0.89 pad 1.52)
  other vias: 69.85,55.88
N$381  (via drill 0.89 pad 1.52)
  other vias: 72.39,25.4
N$382  (via drill 0.89 pad 1.52)
  other vias: 72.39,27.94
N$383  (via drill 0.89 pad 1.52)
  other vias: 72.39,30.48
N$384  (via drill 0.89 pad 1.52)
  other vias: 72.39,33.02
N$385  (via drill 0.89 pad 1.52)
  other vias: 72.39,35.56
N$386  (via drill 0.89 pad 1.52)
  other vias: 72.39,38.1
N$387  (via drill 0.89 pad 1.52)
  other vias: 72.39,40.64
N$388  (via drill 0.89 pad 1.52)
  other vias: 72.39,43.18
N$389  (via drill 0.89 pad 1.52)
  other vias: 72.39,45.72
N$390  (via drill 0.89 pad 1.52)
  other vias: 72.39,48.26
N$391  (via drill 0.89 pad 1.52)
  other vias: 72.39,50.8
N$392  (via drill 0.89 pad 1.52)
  other vias: 72.39,53.34
N$393  (via drill 0.89 pad 1.52)
  other vias: 72.39,55.88
N$394  (via drill 0.89 pad 1.52)
  other vias: 74.93,25.4
N$395  (via drill 0.89 pad 1.52)
  other vias: 74.93,27.94
N$396  (via drill 0.89 pad 1.52)
  other vias: 74.93,30.48
N$397  (via drill 0.89 pad 1.52)
  other vias: 74.93,33.02
N$398  (via drill 0.89 pad 1.52)
  other vias: 6.35,45.72
N$399  (via drill 0.89 pad 1.52)
  other vias: 74.93,35.56
N$400  (via drill 0.89 pad 1.52)
  other vias: 74.93,38.1
N$401  (via drill 0.89 pad 1.52)
  other vias: 74.93,40.64
N$402  (via drill 0.89 pad 1.52)
  other vias: 74.93,43.18
N$403  (via drill 0.89 pad 1.52)
  other vias: 74.93,45.72
N$404  (via drill 0.89 pad 1.52)
  other vias: 74.93,48.26
N$405  (via drill 0.89 pad 1.52)
  other vias: 74.93,50.8
N$406  (via drill 0.89 pad 1.52)
  other vias: 74.93,53.34
N$407  (via drill 0.89 pad 1.52)
  other vias: 74.93,55.88
N$408  (via drill 0.89 pad 1.52)
  other vias: 77.47,25.4
N$409  (via drill 0.89 pad 1.52)
  other vias: 77.47,27.94
N$410  (via drill 0.89 pad 1.52)
  other vias: 77.47,30.48
N$411  (via drill 0.89 pad 1.52)
  other vias: 77.47,33.02
N$412  (via drill 0.89 pad 1.52)
  other vias: 77.47,35.56
N$413  (via drill 0.89 pad 1.52)
  other vias: 77.47,38.1
N$414  (via drill 0.89 pad 1.52)
  other vias: 77.47,40.64
N$415  (via drill 0.89 pad 1.52)
  other vias: 77.47,43.18
N$416  (via drill 0.89 pad 1.52)
  other vias: 77.47,45.72
N$417  (via drill 0.89 pad 1.52)
  other vias: 77.47,48.26
N$418  (via drill 0.89 pad 1.52)
  other vias: 77.47,50.8
N$419  (via drill 0.89 pad 1.52)
  other vias: 77.47,53.34
N$420  (via drill 0.89 pad 1.52)
  other vias: 77.47,55.88
N$421  (via drill 0.89 pad 1.52)
  other vias: 80.01,25.4
N$422  (via drill 0.89 pad 1.52)
  other vias: 80.01,27.94
N$423  (via drill 0.89 pad 1.52)
  other vias: 80.01,30.48
N$424  (via drill 0.89 pad 1.52)
  other vias: 80.01,33.02
N$425  (via drill 0.89 pad 1.52)
  other vias: 80.01,35.56
N$426  (via drill 0.89 pad 1.52)
  other vias: 80.01,38.1
N$427  (via drill 0.89 pad 1.52)
  other vias: 80.01,40.64
N$428  (via drill 0.89 pad 1.52)
  other vias: 80.01,43.18
N$429  (via drill 0.89 pad 1.52)
  other vias: 80.01,45.72
N$430  (via drill 0.89 pad 1.52)
  other vias: 80.01,48.26
N$431  (via drill 0.89 pad 1.52)
  other vias: 6.35,48.26
N$432  (via drill 0.89 pad 1.52)
  other vias: 80.01,50.8
N$433  (via drill 0.89 pad 1.52)
  other vias: 80.01,53.34
N$434  (via drill 0.89 pad 1.52)
  other vias: 80.01,55.88
N$435  (via drill 0.89 pad 1.52)
  other vias: 82.55,25.4
N$436  (via drill 0.89 pad 1.52)
  other vias: 82.55,27.94
N$437  (via drill 0.89 pad 1.52)
  other vias: 82.55,30.48
N$438  (via drill 0.89 pad 1.52)
  other vias: 82.55,33.02
N$439  (via drill 0.89 pad 1.52)
  other vias: 82.55,35.56
N$440  (via drill 0.89 pad 1.52)
  other vias: 82.55,38.1
N$441  (via drill 0.89 pad 1.52)
  other vias: 82.55,40.64
N$442  (via drill 0.89 pad 1.52)
  other vias: 82.55,43.18
N$443  (via drill 0.89 pad 1.52)
  other vias: 82.55,45.72
N$444  (via drill 0.89 pad 1.52)
  other vias: 82.55,48.26
N$445  (via drill 0.89 pad 1.52)
  other vias: 82.55,50.8
N$446  (via drill 0.89 pad 1.52)
  other vias: 82.55,53.34
N$447  (via drill 0.89 pad 1.52)
  other vias: 82.55,55.88
N$448  (via drill 0.89 pad 1.52)
  other vias: 85.09,25.4
N$449  (via drill 0.89 pad 1.52)
  other vias: 85.09,27.94
N$450  (via drill 0.89 pad 1.52)
  other vias: 85.09,30.48
N$451  (via drill 0.89 pad 1.52)
  other vias: 85.09,33.02
N$452  (via drill 0.89 pad 1.52)
  other vias: 85.09,35.56
N$453  (via drill 0.89 pad 1.52)
  other vias: 85.09,38.1
N$454  (via drill 0.89 pad 1.52)
  other vias: 85.09,40.64
N$455  (via drill 0.89 pad 1.52)
  other vias: 85.09,43.18
N$456  (via drill 0.89 pad 1.52)
  other vias: 85.09,45.72
N$457  (via drill 0.89 pad 1.52)
  other vias: 85.09,48.26
N$458  (via drill 0.89 pad 1.52)
  other vias: 85.09,50.8
N$459  (via drill 0.89 pad 1.52)
  other vias: 85.09,53.34
N$460  (via drill 0.89 pad 1.52)
  other vias: 85.09,55.88
N$461  (via drill 0.89 pad 1.52)
  other vias: 87.63,25.4
N$462  (via drill 0.89 pad 1.52)
  other vias: 87.63,27.94
N$463  (via drill 0.89 pad 1.52)
  other vias: 87.63,30.48
N$464  (via drill 0.89 pad 1.52)
  other vias: 6.35,50.8
N$465  (via drill 0.89 pad 1.52)
  other vias: 87.63,33.02
N$466  (via drill 0.89 pad 1.52)
  other vias: 87.63,35.56
N$467  (via drill 0.89 pad 1.52)
  other vias: 87.63,38.1
N$468  (via drill 0.89 pad 1.52)
  other vias: 87.63,40.64
N$469  (via drill 0.89 pad 1.52)
  other vias: 87.63,43.18
N$470  (via drill 0.89 pad 1.52)
  other vias: 87.63,45.72
N$471  (via drill 0.89 pad 1.52)
  other vias: 87.63,48.26
N$472  (via drill 0.89 pad 1.52)
  other vias: 87.63,50.8
N$473  (via drill 0.89 pad 1.52)
  other vias: 87.63,53.34
N$474  (via drill 0.89 pad 1.52)
  other vias: 87.63,55.88
N$475  (via drill 0.89 pad 1.52)
  other vias: 90.17,25.4
N$476  (via drill 0.89 pad 1.52)
  other vias: 90.17,27.94
N$477  (via drill 0.89 pad 1.52)
  other vias: 90.17,30.48
N$478  (via drill 0.89 pad 1.52)
  other vias: 90.17,33.02
N$479  (via drill 0.89 pad 1.52)
  other vias: 90.17,35.56
N$480  (via drill 0.89 pad 1.52)
  other vias: 90.17,38.1
N$481  (via drill 0.89 pad 1.52)
  other vias: 90.17,40.64
N$482  (via drill 0.89 pad 1.52)
  other vias: 90.17,43.18
N$483  (via drill 0.89 pad 1.52)
  other vias: 90.17,45.72
N$484  (via drill 0.89 pad 1.52)
  other vias: 90.17,48.26
N$485  (via drill 0.89 pad 1.52)
  other vias: 90.17,50.8
N$486  (via drill 0.89 pad 1.52)
  other vias: 90.17,53.34
N$487  (via drill 0.89 pad 1.52)
  other vias: 90.17,55.88
N$488  (via drill 0.89 pad 1.52)
  other vias: 92.71,25.4
N$489  (via drill 0.89 pad 1.52)
  other vias: 92.71,27.94
N$490  (via drill 0.89 pad 1.52)
  other vias: 92.71,30.48
N$491  (via drill 0.89 pad 1.52)
  other vias: 92.71,33.02
N$492  (via drill 0.89 pad 1.52)
  other vias: 92.71,35.56
N$493  (via drill 0.89 pad 1.52)
  other vias: 92.71,38.1
N$494  (via drill 0.89 pad 1.52)
  other vias: 92.71,40.64
N$495  (via drill 0.89 pad 1.52)
  other vias: 92.71,43.18
N$496  (via drill 0.89 pad 1.52)
  other vias: 92.71,45.72
N$497  (via drill 0.89 pad 1.52)
  other vias: 6.35,53.34
N$498  (via drill 0.89 pad 1.52)
  other vias: 92.71,48.26
N$499  (via drill 0.89 pad 1.52)
  other vias: 92.71,50.8
N$500  (via drill 0.89 pad 1.52)
  other vias: 92.71,53.34
N$501  (via drill 0.89 pad 1.52)
  other vias: 92.71,55.88
N$502  (via drill 0.89 pad 1.52)
  other vias: 13.97,20.32
N$503  (via drill 0.89 pad 1.52)
  other vias: 13.97,22.86
N$504  (via drill 0.89 pad 1.52)
  other vias: 16.51,20.32
N$505  (via drill 0.89 pad 1.52)
  other vias: 16.51,22.86
N$506  (via drill 0.89 pad 1.52)
  other vias: 19.05,20.32
N$507  (via drill 0.89 pad 1.52)
  other vias: 19.05,22.86
N$508  (via drill 0.89 pad 1.52)
  other vias: 21.59,20.32
N$509  (via drill 0.89 pad 1.52)
  other vias: 21.59,22.86
N$510  (via drill 0.89 pad 1.52)
  other vias: 31.75,20.32
N$511  (via drill 0.89 pad 1.52)
  other vias: 31.75,22.86
N$512  (via drill 0.89 pad 1.52)
  other vias: 34.29,20.32
N$513  (via drill 0.89 pad 1.52)
  other vias: 34.29,22.86
N$514  (via drill 0.89 pad 1.52)
  other vias: 36.83,20.32
N$515  (via drill 0.89 pad 1.52)
  other vias: 36.83,22.86
N$516  (via drill 0.89 pad 1.52)
  other vias: 39.37,20.32
N$517  (via drill 0.89 pad 1.52)
  other vias: 39.37,22.86
N$518  (via drill 0.89 pad 1.52)
  other vias: 41.91,20.32
N$519  (via drill 0.89 pad 1.52)
  other vias: 41.91,22.86
N$520  (via drill 0.89 pad 1.52)
  other vias: 44.45,20.32
N$521  (via drill 0.89 pad 1.52)
  other vias: 44.45,22.86
N$522  (via drill 0.89 pad 1.52)
  other vias: 46.99,20.32
N$523  (via drill 0.89 pad 1.52)
  other vias: 46.99,22.86
N$524  (via drill 0.89 pad 1.52)
  other vias: 49.53,20.32
N$525  (via drill 0.89 pad 1.52)
  other vias: 49.53,22.86
N$526  (via drill 0.89 pad 1.52)
  other vias: 52.07,20.32
N$527  (via drill 0.89 pad 1.52)
  other vias: 52.07,22.86
N$528  (via drill 0.89 pad 1.52)
  other vias: 54.61,20.32
N$529  (via drill 0.89 pad 1.52)
  other vias: 54.61,22.86
N$530  (via drill 0.89 pad 1.52)
  other vias: 6.35,55.88
N$531  (via drill 0.89 pad 1.52)
  other vias: 57.15,20.32
N$532  (via drill 0.89 pad 1.52)
  other vias: 57.15,22.86
N$533  (via drill 0.89 pad 1.52)
  other vias: 59.69,20.32
N$534  (via drill 0.89 pad 1.52)
  other vias: 59.69,22.86
N$535  (via drill 0.89 pad 1.52)
  other vias: 62.23,20.32
N$536  (via drill 0.89 pad 1.52)
  other vias: 62.23,22.86
N$537  (via drill 0.89 pad 1.52)
  other vias: 64.77,20.32
N$538  (via drill 0.89 pad 1.52)
  other vias: 64.77,22.86
N$539  (via drill 0.89 pad 1.52)
  other vias: 67.31,20.32
N$540  (via drill 0.89 pad 1.52)
  other vias: 67.31,22.86
N$541  (via drill 0.89 pad 1.52)
  other vias: 69.85,20.32
N$542  (via drill 0.89 pad 1.52)
  other vias: 69.85,22.86
N$543  (via drill 0.89 pad 1.52)
  other vias: 72.39,20.32
N$544  (via drill 0.89 pad 1.52)
  other vias: 72.39,22.86
N$545  (via drill 0.89 pad 1.52)
  other vias: 74.93,20.32
N$546  (via drill 0.89 pad 1.52)
  other vias: 74.93,22.86
N$547  (via drill 0.89 pad 1.52)
  other vias: 77.47,20.32
N$548  (via drill 0.89 pad 1.52)
  other vias: 77.47,22.86
N$549  (via drill 0.89 pad 1.52)
  other vias: 80.01,20.32
N$550  (via drill 0.89 pad 1.52)
  other vias: 80.01,22.86
N$551  (via drill 0.89 pad 1.52)
  other vias: 82.55,20.32
N$552  (via drill 0.89 pad 1.52)
  other vias: 82.55,22.86
N$553  (via drill 0.89 pad 1.52)
  other vias: 85.09,20.32
N$554  (via drill 0.89 pad 1.52)
  other vias: 85.09,22.86
N$555  (via drill 0.89 pad 1.52)
  other vias: 87.63,20.32
N$556  (via drill 0.89 pad 1.52)
  other vias: 87.63,22.86
N$557  (via drill 0.89 pad 1.52)
  other vias: 90.17,20.32
N$558  (via drill 0.89 pad 1.52)
  other vias: 90.17,22.86
N$559  (via drill 0.89 pad 1.52)
  other vias: 92.71,20.32
N$560  (via drill 0.89 pad 1.52)
  other vias: 92.71,22.86

### Text on the board
tNames: +5V | GND | MSX cartridge board prototype | Board layout by Alexey Podrezov (2017) | +5V | SNDIN | +5V | +5V | GND | GND | D7 | D5 | D3 | D1 | A5 | A3 | A1 | A14 | A12 | A7 | A11 | A9 | RESET | WR | IORQ | M1 | WAIT | CS12 | CS1 | GND | GND | BreadBoard / Version 1.3 | PrOtOtYpE | -12V | +12V | SW2 | SW1 | CLOCK | D6 | D4 | D2 | D0 | A4 | A2 | A0 | A13 | A8 | A6 | A10 | A15 | NC | RD | MREQ | BUSDR | INT | RFSH | SLTSL | CS2
bNames: +5V | GND | MSX cartridge board prototype | Board layout by Alexey Podrezov (2017) | +5V | SNDIN | +5V | +5V | GND | GND | D7 | D5 | D3 | D1 | A5 | A3 | A1 | A14 | A12 | A7 | A11 | A9 | RESET | WR | IORQ | M1 | WAIT | CS12 | CS1 | GND | GND | PrOtOtYpE | BreadBoard / Version 1.3 | -12V | +12V | SW2 | SW1 | CLOCK | D6 | D4 | D2 | D0 | A4 | A2 | A0 | A13 | A8 | A6 | A10 | A15 | NC | RD | MREQ | BUSDR | INT | RFSH | SLTSL | CS2